# EAGLE schematic lego-traffic-lights-controller (EAGLE 9.5.2)
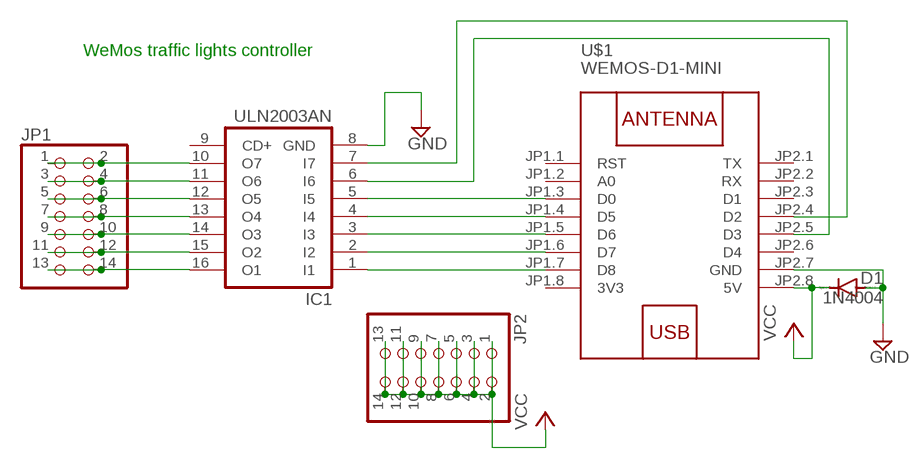
[diagram p0: schematic, sheet 1]

## Parts
D1  1N4004  [DO41-10]
IC1  ULN2003AN  [DIL16]
JP1  PINHD-2X7  [2X07]
JP2  PINHD-2X7  [2X07]
U$1  WEMOS-D1-MINI  [WEMOS-D1-MINI]

## Nets
GND: D1.A IC1.8(GND) U$1.JP2.7(GND)
N$1: IC1.6(I6) U$1.JP2.5(D3)
N$2: IC1.1(I1) U$1.JP1.7(D8)
N$3: IC1.2(I2) U$1.JP1.6(D7)
N$4: IC1.3(I3) U$1.JP1.5(D6)
N$5: IC1.4(I4) U$1.JP1.4(D5)
N$6: IC1.5(I5) U$1.JP1.3(D0)
N$7: IC1.7(I7) U$1.JP2.4(D2)
N$8: IC1.10(O7) JP1.1 JP1.2
N$9: IC1.11(O6) JP1.3 JP1.4
N$10: IC1.12(O5) JP1.5 JP1.6
N$11: IC1.13(O4) JP1.7 JP1.8
N$12: IC1.14(O3) JP1.9 JP1.10
N$13: IC1.15(O2) JP1.11 JP1.12
N$14: IC1.16(O1) JP1.13 JP1.14
VCC: D1.C JP2.1 JP2.2 JP2.3 JP2.4 JP2.5 JP2.6 JP2.7 JP2.8 JP2.9 JP2.10 JP2.11 JP2.12 JP2.13 JP2.14 U$1.JP2.8(5V)
Unconnected: IC1.9(CD+) U$1.JP1.1(RST) U$1.JP1.2(A0) U$1.JP2.1(TX) U$1.JP2.2(RX) U$1.JP2.3(D1) U$1.JP2.6(D4)

## Notes on the sheet
- WeMos traffic lights controller

## Power pins joined to a net without a drawn wire
3V3: U$1.JP1.8(3V3)

## Library data of the parts
D1 = diode:1N4004: DIODE general purpose rectifier, 1 A
IC1 = uln-udn:ULN2003A: DRIVER ARRAY
JP1 JP2 = pinhead:PINHD-2X7: PIN HEADER
U$1 = diy-modules:WEMOS-D1-MINI: WEMOS D1 mini: Mini Wi-Fi Board based on ESP-8266 device More details can be found here: https://www.wemos.cc/product/d1-mini.html Click here to find device on ebay.com <http://www.ebay.com/sch/wemos+d1+mini+nodemcu>